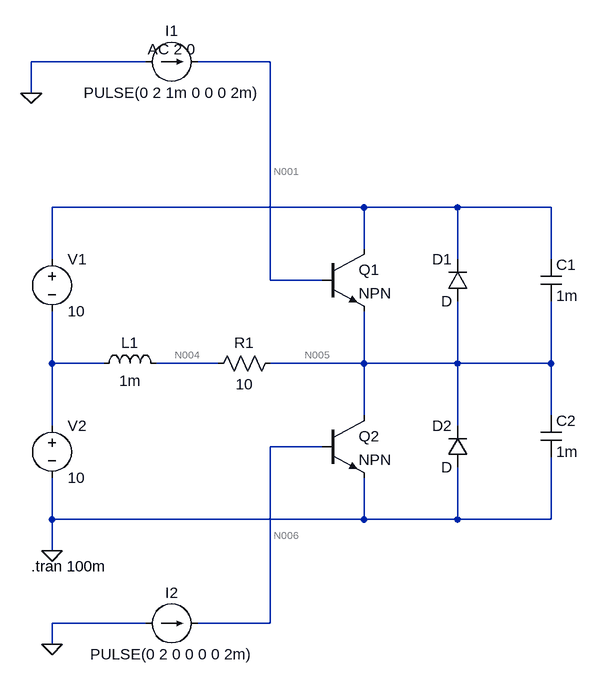
[diagram p0: schematic half_v2.asc]
half_v2.asc, the LTspice schematic file:
Version 4.1
SHEET 1 880 704
WIRE 112 -256 -64 -256
WIRE 304 -256 192 -256
WIRE -64 -208 -64 -256
WIRE 448 -32 -32 -32
WIRE 592 -32 448 -32
WIRE 736 -32 592 -32
WIRE 448 32 448 -32
WIRE -32 48 -32 -32
WIRE 592 48 592 -32
WIRE 736 48 736 -32
WIRE 304 80 304 -256
WIRE 384 80 304 80
WIRE -32 208 -32 128
WIRE 48 208 -32 208
WIRE 224 208 128 208
WIRE 448 208 448 128
WIRE 448 208 304 208
WIRE 592 208 592 112
WIRE 592 208 448 208
WIRE 736 208 736 112
WIRE 736 208 592 208
WIRE 448 288 448 208
WIRE 736 288 736 208
WIRE -32 304 -32 208
WIRE 592 304 592 208
WIRE 384 336 304 336
WIRE -32 448 -32 384
WIRE 448 448 448 384
WIRE 448 448 -32 448
WIRE 592 448 592 368
WIRE 592 448 448 448
WIRE 736 448 736 352
WIRE 736 448 592 448
WIRE -32 496 -32 448
WIRE 112 608 -32 608
WIRE 304 608 304 336
WIRE 304 608 192 608
WIRE -32 640 -32 608
FLAG -32 496 0
FLAG -64 -208 0
FLAG -32 640 0
SYMBOL voltage -32 32 R0
WINDOW 123 0 0 Left 0
WINDOW 39 0 0 Left 0
SYMATTR InstName V1
SYMATTR Value 10
SYMBOL voltage -32 288 R0
WINDOW 123 0 0 Left 0
WINDOW 39 0 0 Left 0
SYMATTR InstName V2
SYMATTR Value 10
SYMBOL res 320 192 R90
WINDOW 0 0 56 VBottom 2
WINDOW 3 32 56 VTop 2
SYMATTR InstName R1
SYMATTR Value 10
SYMBOL ind 32 224 R270
WINDOW 0 32 56 VTop 2
WINDOW 3 5 56 VBottom 2
SYMATTR InstName L1
SYMATTR Value 1m
SYMBOL diode 608 112 R180
WINDOW 0 24 64 Left 2
WINDOW 3 24 0 Left 2
SYMATTR InstName D1
SYMBOL diode 608 368 R180
WINDOW 0 24 64 Left 2
WINDOW 3 24 0 Left 2
SYMATTR InstName D2
SYMBOL npn 384 32 R0
SYMATTR InstName Q1
SYMBOL npn 384 288 R0
SYMATTR InstName Q2
SYMBOL current 112 -256 R270
WINDOW 0 32 40 VTop 2
WINDOW 3 -32 40 VBottom 2
WINDOW 123 4 40 VTop 2
WINDOW 39 0 0 Left 0
SYMATTR InstName I1
SYMATTR Value PULSE(0 2 1m 0 0 0 2m)
SYMATTR Value2 AC 2 0
SYMBOL current 112 608 R270
WINDOW 0 32 40 VTop 2
WINDOW 3 -32 40 VBottom 2
WINDOW 123 0 0 Left 0
WINDOW 39 0 0 Left 0
SYMATTR InstName I2
SYMATTR Value PULSE(0 2 0 0 0 0 2m)
SYMBOL cap 720 48 R0
SYMATTR InstName C1
SYMATTR Value 1m
SYMBOL cap 720 288 R0
SYMATTR InstName C2
SYMATTR Value 1m
TEXT -64 520 Left 2 !.tran 100m

The netlist it stands for:
* half_v2.asc
V1 N002 N003 10
V2 N003 0 10
R1 N005 N004 10
L1 N003 N004 1m
D1 N005 N002 D
D2 0 N005 D
Q1 N002 N001 N005 0 NPN
Q2 N005 N006 0 0 NPN
I1 0 N001 PULSE(0 2 1m 0 0 0 2m) AC 2 0
I2 0 N006 PULSE(0 2 0 0 0 0 2m)
C1 N002 N005 1m
C2 N005 0 1m
.model D D
.lib standard.dio
.model NPN NPN
.model PNP PNP
.lib standard.bjt
.tran 100m
.backanno
.end

* Results of the author's LTspice run, read from the files saved beside the schematic
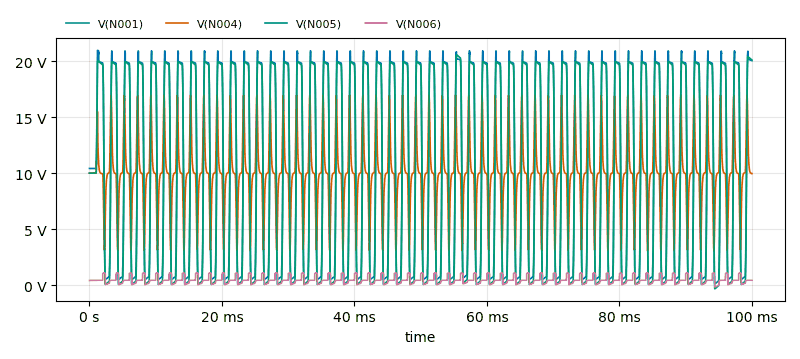
[diagram p1: Transient Analysis of half_v2.asc, plotted from the saved traces]
* Transient Analysis, 1 run:
*   V(N001): min 99.56 mV, max 20.97 V, average 10.55 V, rms 13.71 V, last 20.06 V
*   V(N004): min 3.062 V, max 16.97 V, average 10.01 V, rms 10.47 V, last 9.956 V
*   V(N005): min -334.6 mV, max 20.58 V, average 10.11 V, rms 13.45 V, last 20.11 V
*   V(N006): min -182.9 mV, max 1.09 V, average 447 mV, rms 558.5 mV, last 433.8 mV